# EAGLE design KNOT_v1_0_main (EAGLE 7.3.0)

## Sheet 1 of 3
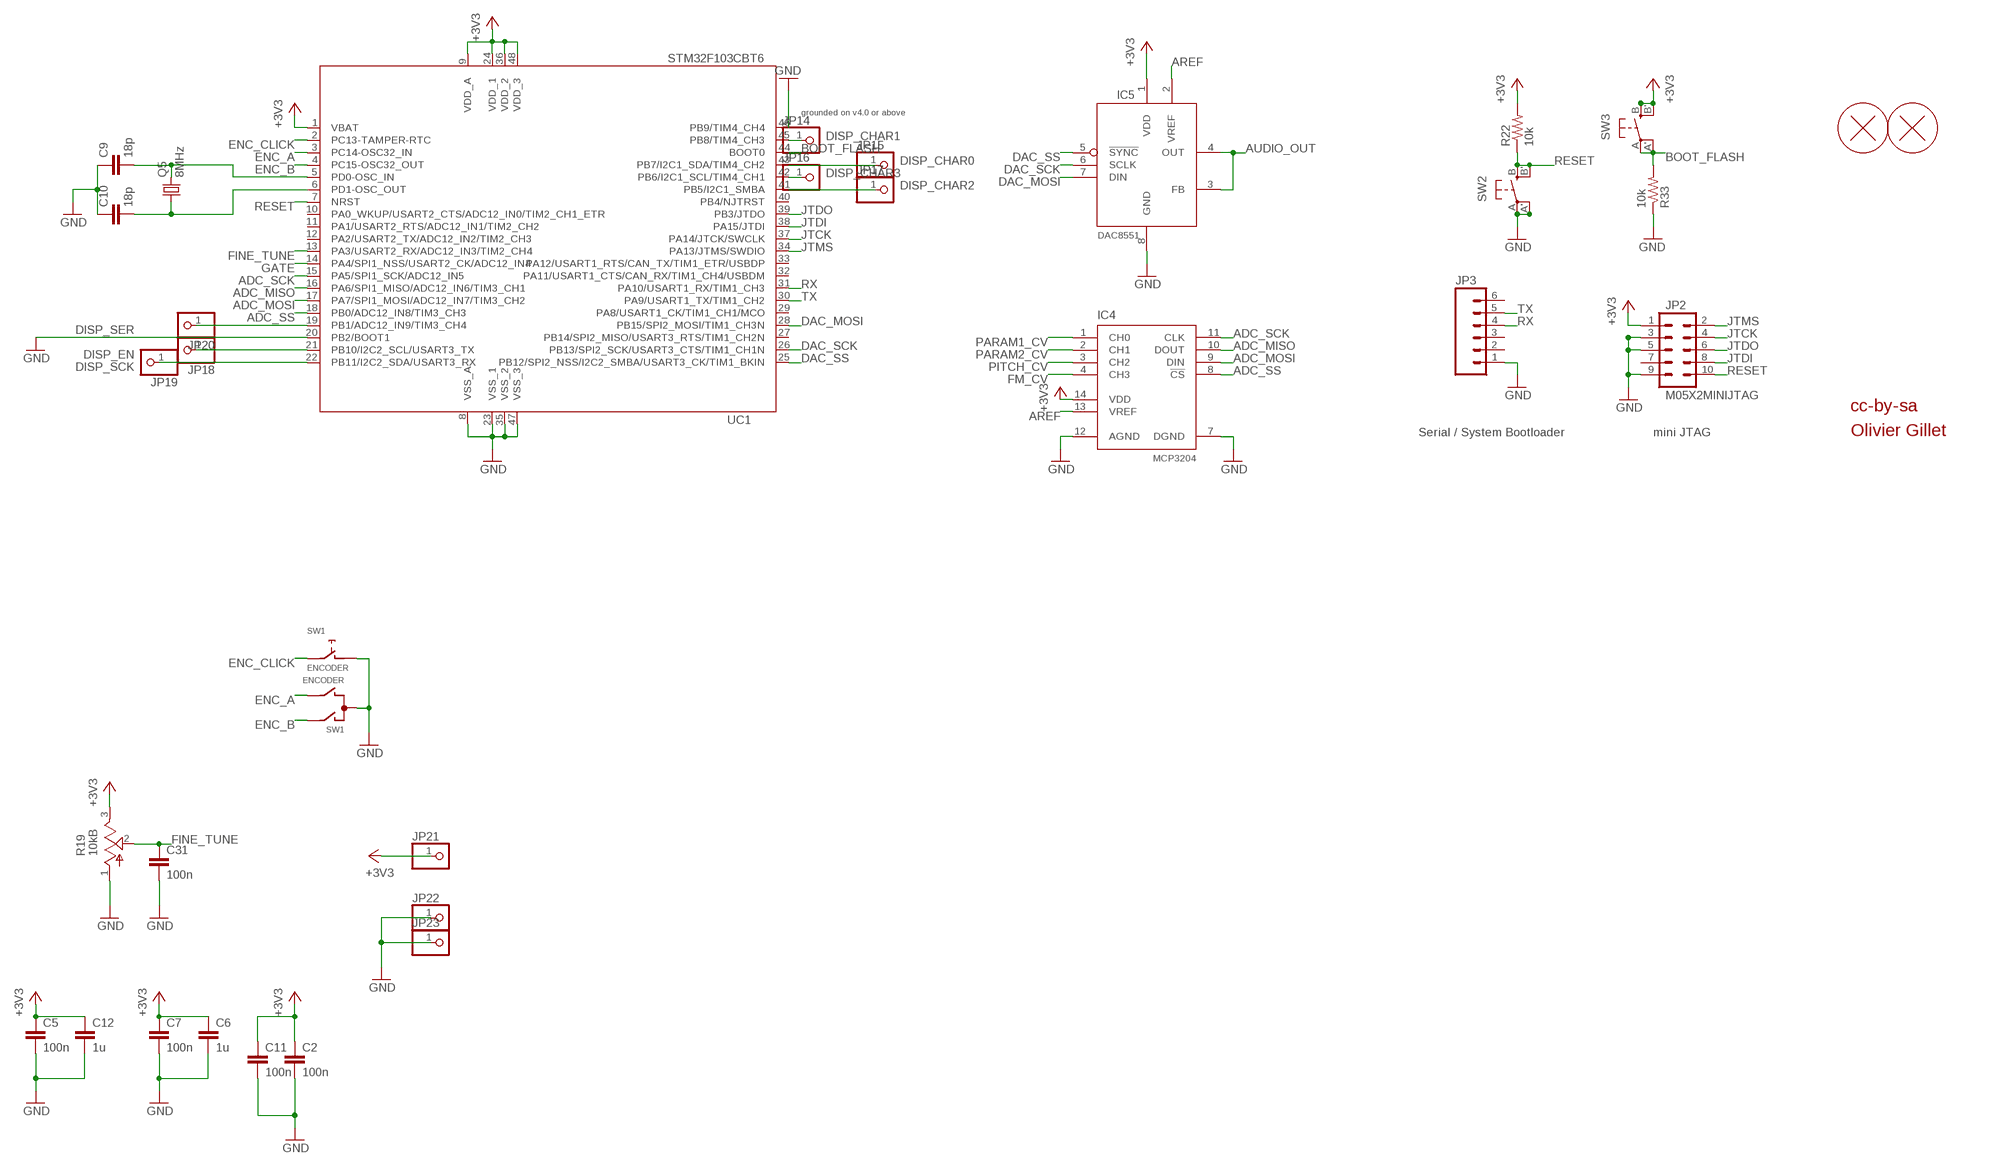
[diagram p0: schematic, sheet 1]

### Parts
C2  100n  CAPACITOR  [RESISTOR_0603]
C5  100n  CAPACITOR  [RESISTOR_0603]
C6  1u  CAPACITOR  [RESISTOR_0603]
C7  100n  CAPACITOR  [RESISTOR_0603]
C9  18p  CAPACITOR  [RESISTOR_0603]
C10  18p  CAPACITOR  [RESISTOR_0603]
C11  100n  CAPACITOR  [RESISTOR_0603]
C12  1u  CAPACITOR  [RESISTOR_0603]
C31  100n  CAPACITOR  [RESISTOR_0603]
H1  PCB_SCREW  [PCB_SCREW]
H2  PCB_SCREW  [PCB_SCREW]
IC4  MCP3204  MCP3302  [SO14]
IC5  DAC8551  DAC855X  [MSOP-8]
JP2  M05X2MINIJTAG  [2X5-1.27]
JP3  M06SIP  [1X06]
JP14  PINHD-1X1  [1X01]
JP15  PINHD-1X1  [1X01]
JP16  PINHD-1X1  [1X01]
JP17  PINHD-1X1  [1X01]
JP18  PINHD-1X1  [1X01]
JP19  PINHD-1X1  [1X01]
JP20  PINHD-1X1  [1X01]
JP21  PINHD-1X1  [1X01]
JP22  PINHD-1X1  [1X01]
JP23  PINHD-1X1  [1X01]
Q5  8MHz  CRYSTAL  [HC49UP]
R19  10kB  POT_VERTICAL  [ALPS_POT_VERTICAL]
R22  10k  RESISTOR  [RESISTOR_0603]
R33  10k  RESISTOR  [RESISTOR_0603]
SW1  ENCODER  [ALPS_EC12E_SW]
SW2  EVQQ2  [EVQ-Q2]
SW3  EVQQ2  [EVQ-Q2]
UC1  STM32F103CBT6  STM32F103CB  [LQFP48]

### Nets
+3V3 [mwide]: C2.1 C5.1 C6.1 C7.1 C11.1 C12.1 IC4.14(VDD) IC5.1(VDD) JP2.1 JP21.1 R19.3(B) R22.2 SW3.B'(S1) SW3.B(S) UC1.1(VBAT) UC1.9(VDD_A) UC1.24(VDD_1) UC1.36(VDD_2) UC1.48(VDD_3) ; also sheet 2,3
ADC_MISO: IC4.10(DOUT) UC1.16(PA6/SPI1_MISO/ADC12_IN6/TIM3_CH1)
ADC_MOSI: IC4.9(DIN) UC1.17(PA7/SPI1_MOSI/ADC12_IN7/TIM3_CH2)
ADC_SCK: IC4.11(CLK) UC1.15(PA5/SPI1_SCK/ADC12_IN5)
ADC_SS: IC4.8(!CS) UC1.18(PB0/ADC12_IN8/TIM3_CH3)
AREF: IC4.13(VREF) IC5.2(VREF) ; also sheet 3
AUDIO_OUT: IC5.3(FB) IC5.4(OUT) ; also sheet 2
BOOT_FLASH: R33.2 SW3.A'(P1) SW3.A(P) UC1.44(BOOT0)
DAC_MOSI: IC5.7(DIN) UC1.28(PB15/SPI2_MOSI/TIM1_CH3N)
DAC_SCK: IC5.6(SCLK) UC1.26(PB13/SPI2_SCK/USART3_CTS/TIM1_CH1N)
DAC_SS: IC5.5(!SYNC) UC1.25(PB12/SPI2_NSS/I2C2_SMBA/USART3_CK/TIM1_BKIN)
DISP_CHAR0: JP15.1 UC1.43(PB7/I2C1_SDA/TIM4_CH2)
DISP_CHAR1: JP14.1 UC1.45(PB8/TIM4_CH3)
DISP_CHAR2: JP17.1 UC1.41(PB5/I2C1_SMBA)
DISP_CHAR3: JP16.1 UC1.42(PB6/I2C1_SCL/TIM4_CH1)
DISP_EN: JP18.1 UC1.21(PB10/I2C2_SCL/USART3_TX)
DISP_SCK: JP19.1 UC1.22(PB11/I2C2_SDA/USART3_RX)
DISP_SER: JP20.1 UC1.19(PB1/ADC12_IN9/TIM3_CH4)
ENC_A: SW1.B UC1.3(PC14-OSC32_IN)
ENC_B: SW1.A UC1.4(PC15-OSC32_OUT)
ENC_CLICK: SW1.E UC1.2(PC13-TAMPER-RTC)
FINE_TUNE: C31.1 R19.2(W) UC1.13(PA3/USART2_RX/ADC12_IN3/TIM2_CH4)
FM_CV: IC4.4(CH3) ; also sheet 2
GATE: UC1.14(PA4/SPI1_NSS/USART2_CK/ADC12_IN4) ; also sheet 2
GND: C2.2 C5.2 C6.2 C7.2 C9.1 C10.1 C11.2 C12.2 C31.2 IC4.7(DGND) IC4.12(AGND) IC5.8(GND) JP2.3 JP2.5 JP2.9 JP3.1 JP22.1 JP23.1 R19.1(A) R33.1 SW1.C SW1.D SW2.A'(P1) SW2.A(P) UC1.8(VSS_A) UC1.20(PB2/BOOT1) UC1.23(VSS_1) UC1.35(VSS_2) UC1.46(PB9/TIM4_CH4) UC1.47(VSS_3) ; also sheet 2,3
JTCK: JP2.4 UC1.37(PA14/JTCK/SWCLK)
JTDI: JP2.8 UC1.38(PA15/JTDI)
JTDO: JP2.6 UC1.39(PB3/JTDO)
JTMS: JP2.2 UC1.34(PA13/JTMS/SWDIO)
N$7: C9.2 Q5.2 UC1.5(PD0-OSC_IN)
N$8: C10.2 Q5.1 UC1.6(PD1-OSC_OUT)
PARAM1_CV: IC4.1(CH0) ; also sheet 2
PARAM2_CV: IC4.2(CH1) ; also sheet 2
PITCH_CV: IC4.3(CH2) ; also sheet 2
RESET: JP2.10 R22.1 SW2.B'(S1) SW2.B(S) UC1.7(NRST)
RX: JP3.4 UC1.31(PA10/USART1_RX/TIM1_CH3)
TX: JP3.5 UC1.30(PA9/USART1_TX/TIM1_CH2)
Unconnected: JP2.7 JP3.2 JP3.3 JP3.6 SW1.GND1(G) SW1.GND2(G) UC1.10(PA0_WKUP/USART2_CTS/ADC12_IN0/TIM2_CH1_ETR) UC1.11(PA1/USART2_RTS/ADC12_IN1/TIM2_CH2) UC1.12(PA2/USART2_TX/ADC12_IN2/TIM2_CH3) UC1.27(PB14/SPI2_MISO/USART3_RTS/TIM1_CH2N) UC1.29(PA8/USART1_CK/TIM1_CH1/MCO) UC1.32(PA11/USART1_CTS/CAN_RX/TIM1_CH4/USBDM) UC1.33(PA12/USART1_RTS/CAN_TX/TIM1_ETR/USBDP) UC1.40(PB4/NJTRST)

### Notes on the sheet
- grounded on v4.0 or above
- cc-by-sa
- Serial / System Bootloader | mini JTAG | Olivier Gillet

## Sheet 2 of 3
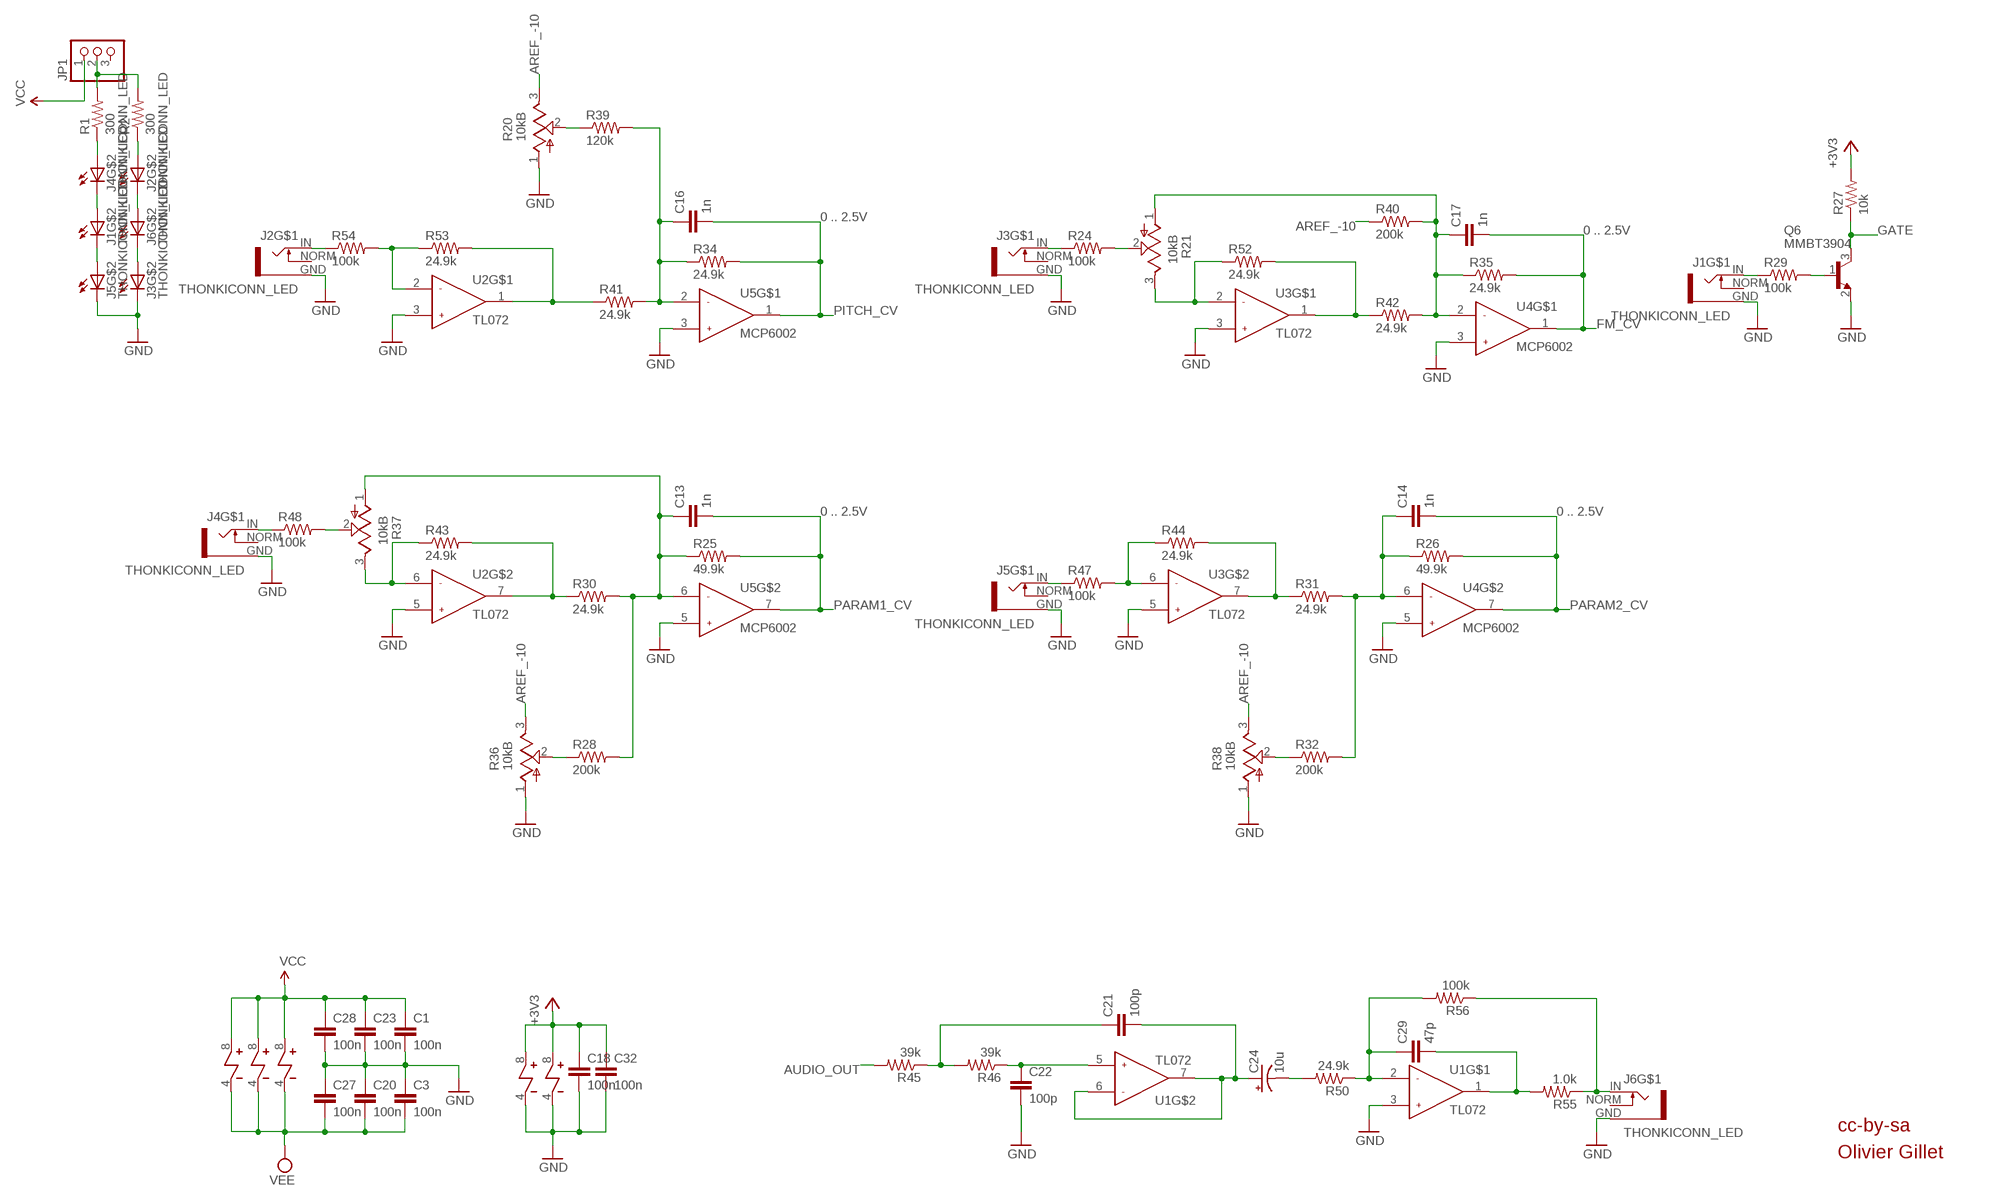
[diagram p1: schematic, sheet 2]

### Parts
C1  100n  CAPACITOR  [RESISTOR_0603]
C3  100n  CAPACITOR  [RESISTOR_0603]
C13  1n  CAPACITOR  [RESISTOR_0603]
C14  1n  CAPACITOR  [RESISTOR_0603]
C16  1n  CAPACITOR  [RESISTOR_0603]
C17  1n  CAPACITOR  [RESISTOR_0603]
C18  100n  CAPACITOR  [RESISTOR_0603]
C20  100n  CAPACITOR  [RESISTOR_0603]
C21  100p  CAPACITOR  [RESISTOR_0603]
C22  100p  CAPACITOR  [RESISTOR_0603]
C23  100n  CAPACITOR  [RESISTOR_0603]
C24  10u  CAP_POL  [PANASONIC_B]
C27  100n  CAPACITOR  [RESISTOR_0603]
C28  100n  CAPACITOR  [RESISTOR_0603]
C29  47p  CAPACITOR  [RESISTOR_0603]
C32  100n  CAPACITOR  [RESISTOR_0603]
J1  THONKICONN_LED  [LED_JACK]
J2  THONKICONN_LED  [LED_JACK]
J3  THONKICONN_LED  [LED_JACK]
J4  THONKICONN_LED  [LED_JACK]
J5  THONKICONN_LED  [LED_JACK]
J6  THONKICONN_LED  [LED_JACK]
JP1  PINHD-1X3  [1X03]
Q6  MMBT3904  MMBT3904SOT23  [SOT23]
R1  300  RESISTOR  [RESISTOR_0603]
R2  300  RESISTOR  [RESISTOR_0603]
R20  10kB  POT_VERTICAL  [ALPS_POT_VERTICAL]
R21  10kB  POT_VERTICAL  [ALPS_POT_VERTICAL]
R24  100k  RESISTOR  [RESISTOR_0603]
R25  49.9k  RESISTOR  [RESISTOR_0603]
R26  49.9k  RESISTOR  [RESISTOR_0603]
R27  10k  RESISTOR  [RESISTOR_0603]
R28  200k  RESISTOR  [RESISTOR_0603]
R29  100k  RESISTOR  [RESISTOR_0603]
R30  24.9k  RESISTOR  [RESISTOR_0603]
R31  24.9k  RESISTOR  [RESISTOR_0603]
R32  200k  RESISTOR  [RESISTOR_0603]
R34  24.9k  RESISTOR  [RESISTOR_0603]
R35  24.9k  RESISTOR  [RESISTOR_0603]
R36  10kB  POT_VERTICAL  [ALPS_POT_VERTICAL]
R37  10kB  POT_VERTICAL  [ALPS_POT_VERTICAL]
R38  10kB  POT_VERTICAL  [ALPS_POT_VERTICAL]
R39  120k  RESISTOR  [RESISTOR_0603]
R40  200k  RESISTOR  [RESISTOR_0603]
R41  24.9k  RESISTOR  [RESISTOR_0603]
R42  24.9k  RESISTOR  [RESISTOR_0603]
R43  24.9k  RESISTOR  [RESISTOR_0603]
R44  24.9k  RESISTOR  [RESISTOR_0603]
R45  39k  RESISTOR  [RESISTOR_0603]
R46  39k  RESISTOR  [RESISTOR_0603]
R47  100k  RESISTOR  [RESISTOR_0603]
R48  100k  RESISTOR  [RESISTOR_0603]
R50  24.9k  RESISTOR  [RESISTOR_0603]
R52  24.9k  RESISTOR  [RESISTOR_0603]
R53  24.9k  RESISTOR  [RESISTOR_0603]
R54  100k  RESISTOR  [RESISTOR_0603]
R55  1.0k  RESISTOR  [RESISTOR_0603]
R56  100k  RESISTOR  [RESISTOR_0603]
U1  TL072  OPAMP_DUAL  [SOIC8]
U2  TL072  OPAMP_DUAL  [SOIC8]
U3  TL072  OPAMP_DUAL  [SOIC8]
U4  MCP6002  OPAMP_DUAL  [SOIC8]
U5  MCP6002  OPAMP_DUAL  [SOIC8]

### Nets
+3V3 [mwide]: C18.1 C32.1 R27.2 U4.8 U5.8 ; also sheet 1,3
AREF_-10: R20.3(B) R36.3(B) R38.3(B) R40.1 ; also sheet 3
AUDIO_OUT: R45.2 ; also sheet 1
FM_CV: C17.2 R35.2 U4.1 ; also sheet 1
GATE: Q6.3(C) R27.1 ; also sheet 1
GND: C1.2 C3.1 C18.2 C20.1 C22.2 C23.2 C27.1 C28.2 C32.2 J1.GND J2.GND J3.C J3.GND J4.GND J5.C J5.GND J6.GND Q6.2(E) R20.1(A) R36.1(A) R38.1(A) U1.3 U2.3 U2.5 U3.3 U3.5 U4.3 U4.4 U4.5 U5.3 U5.4 U5.5 ; also sheet 1,3
N$3 [mwide]: J3.A J6.C
N$4 [mwide]: J2.C J6.A
N$5: J2.A R2.1
N$6 [mwide]: J1.C J5.A
N$9 [mwide]: J1.A J4.C
N$10 [mwide]: J4.A R1.1
N$11 [mwide]: JP1.2 R1.2 R2.2
N$12: R41.1 R53.2 U2.1
N$13: R20.2(W) R39.1
N$14: J2.IN R54.1
N$29: C16.1 R34.1 R39.2 R41.2 U5.2
N$45: R53.1 R54.2 U2.2
N$46: J3.IN R24.1
N$47: J4.IN R48.1
N$48: R21.2(W) R24.2
N$50: R37.3(B) R43.1 U2.6
N$51: R30.1 R43.2 U2.7
N$52: R21.3(B) R52.1 U3.2
N$53: R42.1 R52.2 U3.1
N$55: C17.1 R21.1(A) R35.1 R40.2 R42.2 U4.2
N$57: J1.IN R29.1
N$58: R31.1 R44.2 U3.7
N$59: C13.1 R25.1 R28.2 R30.2 R37.1(A) U5.6
N$60: J5.IN R47.1
N$61: R28.1 R36.2(W)
N$62: R37.2(W) R48.2
N$63: R44.1 R47.2 U3.6
N$65: R32.1 R38.2(W)
N$66: Q6.1(B) R29.2
N$67: C21.2 C24.+ U1.6 U1.7
N$68: C24.- R50.2
N$69: C22.1 R46.1 U1.5
N$70: C14.1 R26.1 R31.2 R32.2 U4.6
N$71: C21.1 R45.1 R46.2
N$72: J6.IN R55.1 R56.1
N$73: C29.2 R55.2 U1.1
N$75: C29.1 R50.1 R56.2 U1.2
PARAM1_CV: C13.2 R25.2 U5.7 ; also sheet 1
PARAM2_CV: C14.2 R26.2 U4.7 ; also sheet 1
PITCH_CV: C16.2 R34.2 U5.1 ; also sheet 1
VCC [wide]: C1.1 C23.1 C28.1 JP1.1 U1.8 U2.8 U3.8 ; also sheet 3
VEE [wide]: C3.2 C20.2 C27.2 U1.4 U2.4 U3.4 ; also sheet 3
Unconnected: J1.NORM J2.NORM J3.NORM J4.NORM J5.NORM J6.NORM JP1.3

### Notes on the sheet
- 0 .. 2.5V
- 0 .. 2.5V
- 0 .. 2.5V | 0 .. 2.5V
- cc-by-sa
- Olivier Gillet

## Sheet 3 of 3
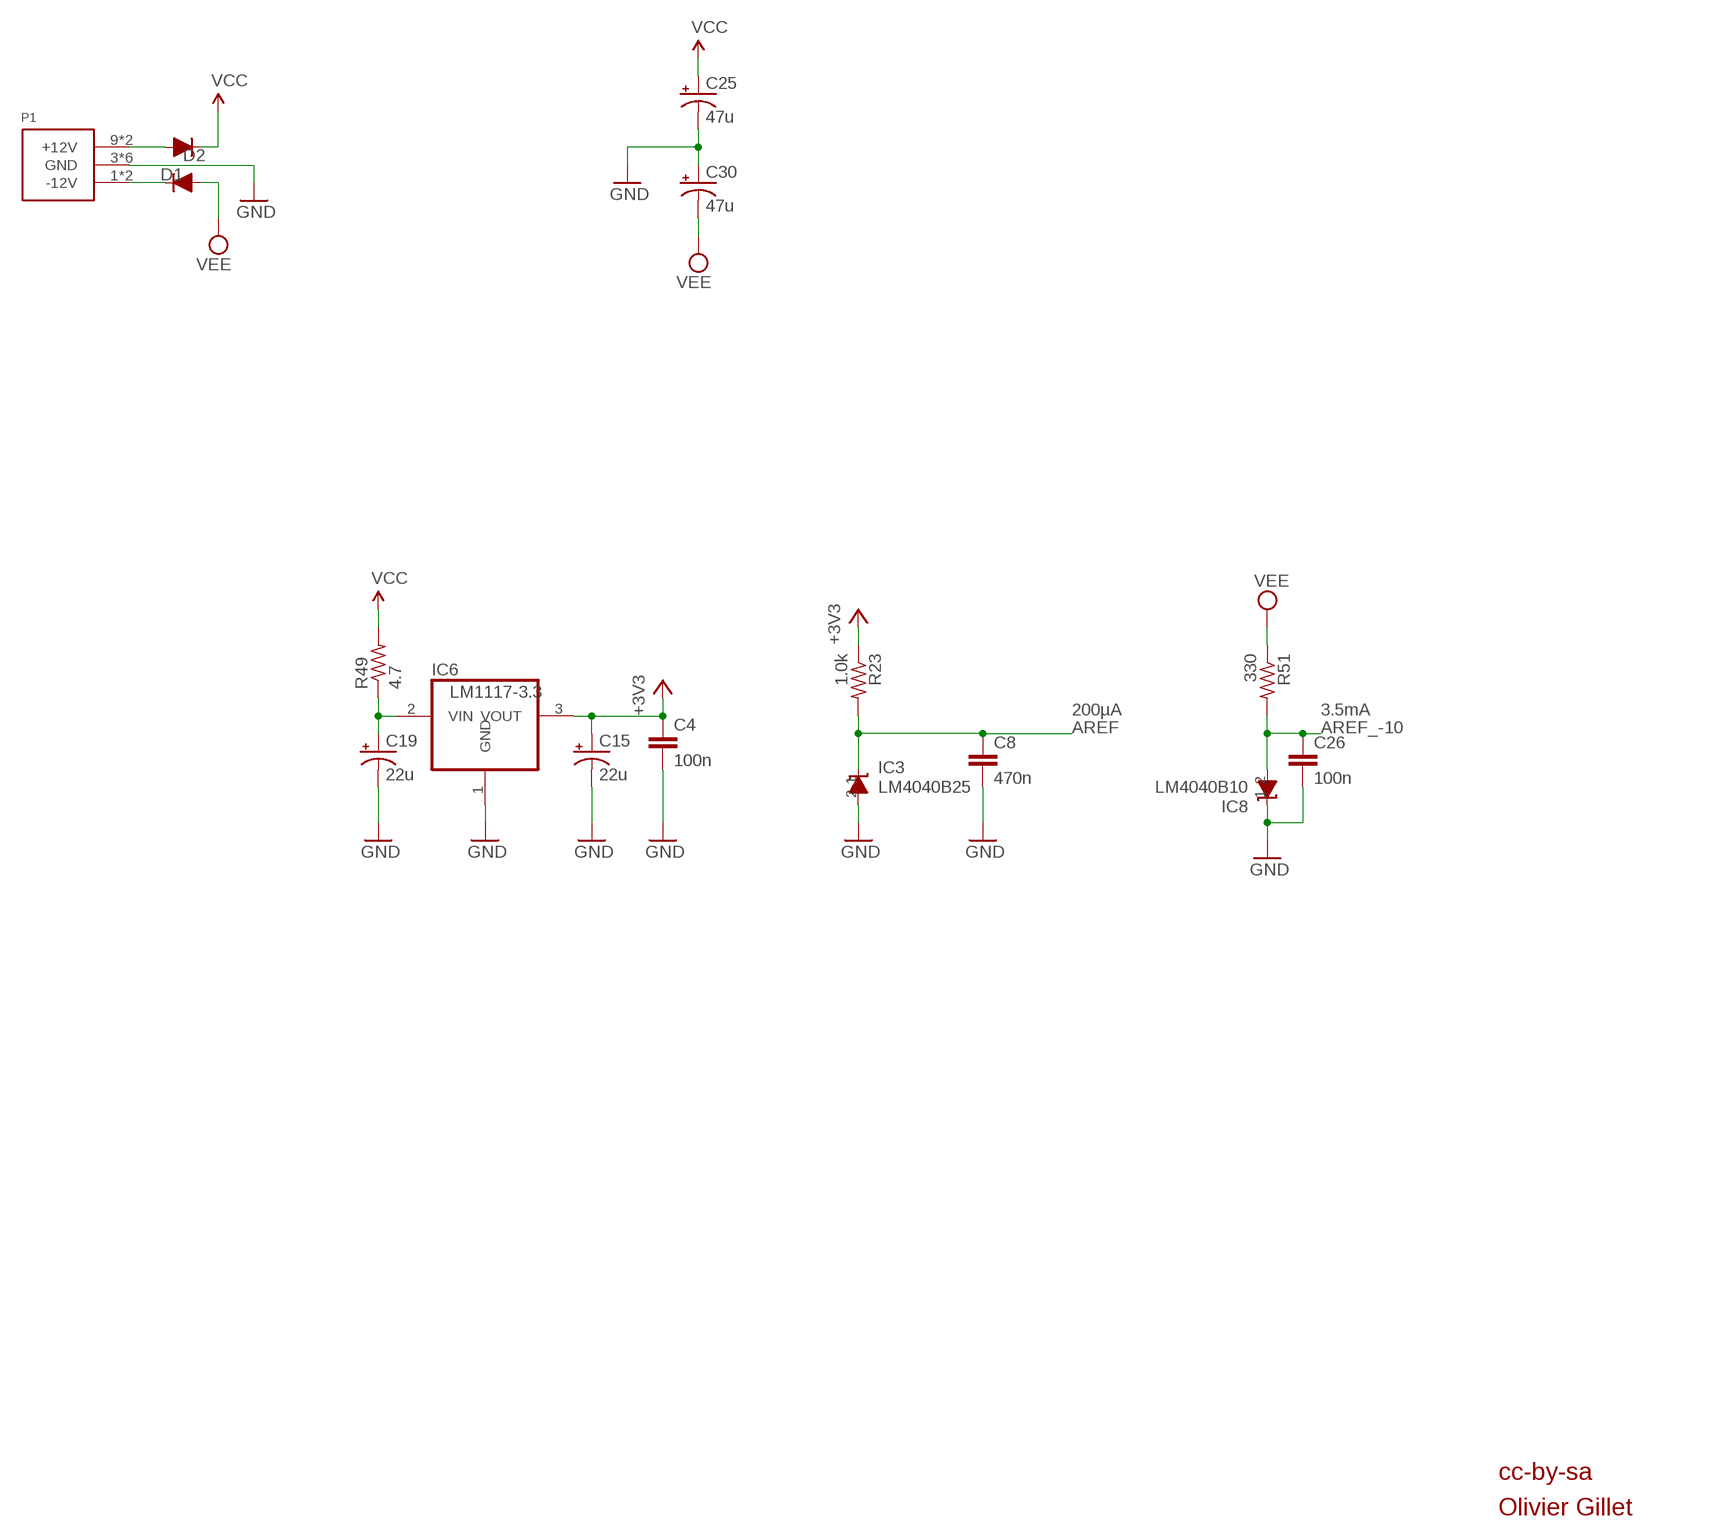
[diagram p2: schematic, sheet 3]

### Parts
C4  100n  CAPACITOR  [RESISTOR_0603]
C8  470n  CAPACITOR  [RESISTOR_0603]
C15  22u  CAP_POLD  [PANASONIC_D]
C19  22u  CAP_POLD  [PANASONIC_D]
C25  47u  CAP_POLD  [PANASONIC_D]
C26  100n  CAPACITOR  [RESISTOR_0603]
C30  47u  CAP_POLD  [PANASONIC_D]
D1  1N5819HW  DIODE  [SOD123]
D2  1N5819HW  DIODE  [SOD123]
IC3  LM4040B25  LM4040SOT23  [SOT23]
IC6  LM1117-3.3  REG1117T  [TO252]
IC8  LM4040B10  LM4040SOT23  [SOT23]
P1  POWER_SIMPLE10  [POWER_10]
R23  1.0k  RESISTOR  [RESISTOR_0603]
R49  4.7  RESISTOR  [RESISTOR_0603]
R51  330  RESISTOR  [RESISTOR_0603]

### Nets
+3V3 [mwide]: C4.1 C15.+ IC6.3(VOUT) R23.1 ; also sheet 1,2
AREF: C8.1 IC3.1(C) R23.2 ; also sheet 1
AREF_-10: C26.1 IC8.2(A) R51.2 ; also sheet 2
GND: C4.2 C8.2 C15.- C19.- C25.- C26.2 C30.+ IC3.2(A) IC6.1(GND) IC8.1(C) P1.3(GND) P1.4(GND) P1.5(GND) P1.6(GND) P1.7(GND) P1.8(GND) ; also sheet 1,2
N$1 [wide]: D1.+ P1.9(+12V) P1.10(+12V)
N$2 [wide]: D2.- P1.1(-12V) P1.2(-12V)
N$49: C19.+ IC6.2(VIN) R49.1
VCC [wide]: C25.+ D1.- R49.2 ; also sheet 2
VEE [wide]: C30.- D2.+ R51.1 ; also sheet 2

### Notes on the sheet
- 200µA | 3.5mA
- cc-by-sa
- Olivier Gillet

## Library data of the parts
C1-C14 C16-C18 C20-C23 C26-C29 C31 C32 = parts_aman:CAPACITOR
C15 C19 C24 C25 C30 = parts_aman:CAP_POL
D1 D2 = parts_aman:DIODE
H1 H2 = parts_aman:PCB_SCREW
IC3 IC8 = parts_aman:LM4040
IC4 = og-adc:MCP3302
IC5 = og-dac:DAC855X: 16-bit low-glitch DAC with 2's complement (8550) or unsigned code (8551)
IC6 = og-vreg:REG1117: 800mA and 1A Low Dropout (LDO) Positive Regulator 1.8V, 2.5V, 2.85V, 3.3V, 5V, and Adj
J1-J6 = parts_aman:THONKICONN_LED
JP1 = parts_aman:PINHD-1X3: PIN HEADER
JP2 = og-header:M05X2: Header 5x2 Standard 10-pin dual row 0.1" header. Commonly used with AVR-ISP. Use with Spark Fun Electronics SKU: PRT-00778
JP3 = SparkFun:M06: Header 6 Standard 6-pin 0.1" header. Use with straight break away headers (SKU : PRT-00116), right angle break away headers (PRT-00553), swiss pins (PRT-00743), machine pins (PRT-00117), and female headers (PRT-00115). Molex polarized connector foot print use with SKU : PRT-08094 with associated crimp pins and housings. NOTES ON THE VARIANTS LOCK and LOCK_LONGPADS... This footprint was designed to help hold the alignment of a through-hole component (i.e. 6-pin header) while soldering it into place. You may notice that each hole has been shifted either up or down by 0.005 of an inch from it's more standard position (which is a perfectly straight line). This slight alteration caused the pins (the squares in the middle) to touch the edges of the holes. Because they are alternating, it causes a "brace" to hold the component in place. 0.005 has proven to be the perfect amount of "off-center" position when using our standard breakaway headers. Although looks a little odd when you look at the bare footprint, once you have a header in there, the alteration is very hard to notice. Also, if you push a header all the way into place, it is covered up entirely on the bottom side. This idea of altering the position of holes to aid alignment will be further integrated into the Sparkfun Library for other footprints. It can help hold any component with 3 or more connection pins.
JP14-JP23 = parts_aman:PINHD-1X1: PIN HEADER
P1 = parts_aman:POWER_SIMPLE
Q5 = parts_aman:CRYSTAL
Q6 = parts_aman:MMBT3904
R1 R2 R22-R35 R39-R56 = parts_aman:RESISTOR
R19-R21 R36-R38 = parts_aman:POT_VERTICAL
SW1 = parts_aman:ENCODER: ALPS rotary Encoder EC12E series with switch; MPN: EC12E2424407; OC_FARNELL: 1520813; OC_NEWARK: 74M1068
SW2 SW3 = adafruit:EVQQ2: SMT 6mm switch, EVQQ2 series http://www.ladyada.net/library/eagle
U1-U5 = parts_aman:OPAMP_DUAL
UC1 = stm32:STM32F103CB

## Net classes
0 default: width 0.152 mm, drill 0.305 mm, clearance 0.152 mm
1 wide: width 0.305 mm, drill 0.305 mm, clearance 0.152 mm
2 mwide: width 0.229 mm, drill 0.305 mm, clearance 0.152 mm

## Board
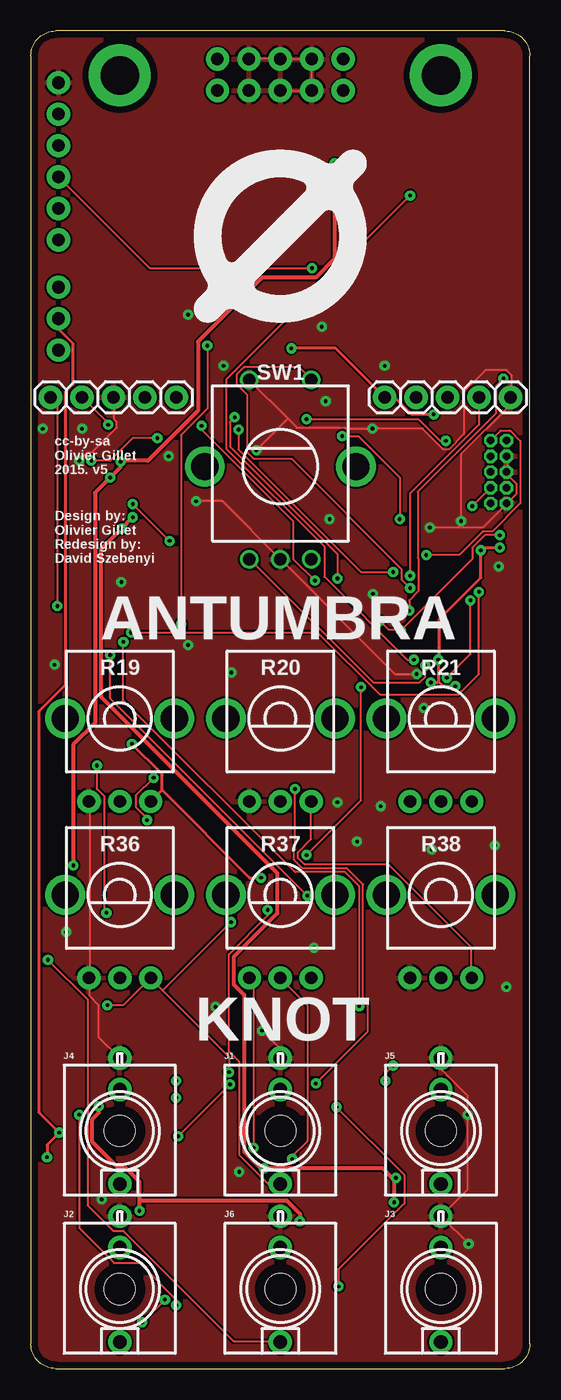
[diagram p3: board, top side]
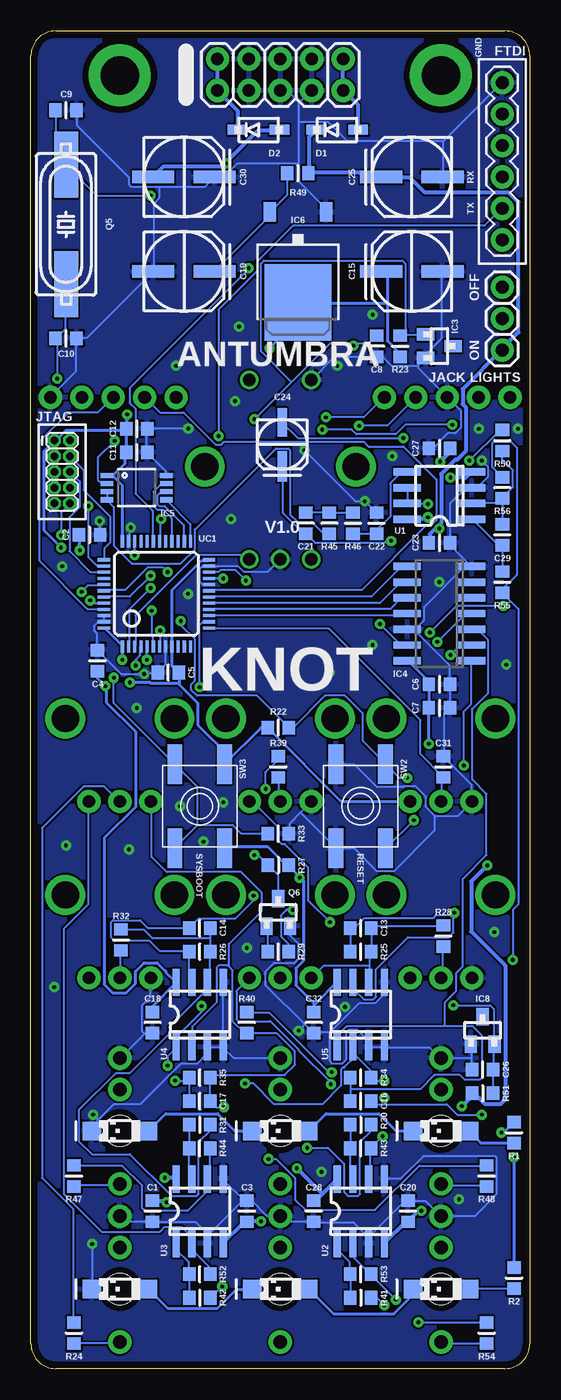
[diagram p4: board, bottom side, seen from below]

Size 40.3 x 108 mm. Coordinates in mm from the lower left corner, seen from the top.
Outline: 2,0 38.3,0 arc90 40.3,2 40.3,106 arc90 38.3,108 2,108 arc90 0,106 0,2 arc90 2,0
Copper layers (1*16): Top 0.035mm / dielectric 1.5mm / Bottom 0.035mm
Design rules "PCBCart-Standard": minimum track width 6mil, minimum drill 12mil, track to track 6mil, track to pad 6mil, pad to pad 6mil, via to via 6mil, smd to smd 6mil, copper to edge 20mil, drill to drill 8mil, minimum pad ring 8mil, minimum via ring 10mil, stop-mask expansion 3mil, vias tented up to drill 25mil, thermal gap 8mil

### Footprints (pad centres in the part's own frame; a part is rotated, then mirrored left to right if it is on the bottom)
RESISTOR_0603 = smd 1 x 1.1: 1 -0.85,0; 2 0.85,0
PANASONIC_D = smd 3.4 x 1: + 2.478,0; - -2.478,0
PANASONIC_B = smd 2.464 x 0.762: + 1.778,0 | smd 2.286 x 0.762: - -1.778,0
SOD123 = smd 1.6 x 0.8: + 1.7,0; - -1.7,0
PCB_SCREW = drill 3.1 pad 5: P$1 0,0
SOT23 = smd 1 x 1.4: 1 -0.95,-1.1; 2 0.95,-1.1; 3 0,1.1
SO14 = smd 0.6 x 2.2: 1 -3.81,-2.6; 2 -2.54,-2.6; 3 -1.27,-2.6; 4 0,-2.6; 5 1.27,-2.6; 6 2.54,-2.6; 7 3.81,-2.6; 8 3.81,2.6; 9 2.54,2.6; 10 1.27,2.6; 11 0,2.6; 12 -1.27,2.6; 13 -2.54,2.6; 14 -3.81,2.6
MSOP-8 = smd 0.41 x 1.02: 1 -0.975,-2.4; 2 -0.325,-2.4; 3 0.325,-2.4; 4 0.975,-2.4; 5 0.975,2.4; 6 0.325,2.4; 7 -0.325,2.4; 8 -0.975,2.4
TO252 = smd 1 x 1.6: 1 -2.28,-4.8; 2 2.28,-4.8 | smd 5.4 x 6.2: 3 0,2.5
LED_JACK = smd 1.5 x 1.5 bottom: A 2.266,0; C -2.266,0 | drill 1.1 pad 1.88: GND 0,-5.88; IN 0,4.28; NORM 0,-3.34 | hole 2.5: 0,0
1X03 = drill 1.016 pad 1.88: 1 -2.54,0; 2 0,0; 3 2.54,0
2X5-1.27 = drill 0.61 pad 1.067 octagon: 1 -1.27,3.81; 2 0,3.81; 3 -1.27,2.54; 4 0,2.54; 5 -1.27,1.27; 6 0,1.27; 7 -1.27,0; 8 0,0; 9 -1.27,-1.27; 10 0,-1.27
1X06 = drill 1.016 pad 1.88: 1 0,0; 2 2.54,0; 3 5.08,0; 4 7.62,0; 5 10.16,0; 6 12.7,0
1X01 = drill 1.016 pad 1.88: 1 0,0
POWER_10 = drill 1.016 pad 1.88: 1 -5.08,-1.27; 2 -5.08,1.27; 3 -2.54,-1.27; 4 -2.54,1.27; 5 0,-1.27; 6 0,1.27; 7 2.54,-1.27; 8 2.54,1.27; 9 5.08,-1.27; 10 5.08,1.27
HC49UP = smd 5.334 x 1.93: 1 -4.826,0; 2 4.826,0
ALPS_POT_VERTICAL = drill 1 pad 1.88: 1 -2.5,-6.7; 2 0,-6.7; 3 2.5,-6.7 | drill 2.2 pad 3.175: P$4 4.4,0; P$5 -4.4,0
ALPS_EC12E_SW = drill 1: A -2.5,-7.5; B 2.5,-7.5; C 0,-7.5; D -2.5,7; E 2.5,7 | drill 2.2: GND1 -6.1,0; GND2 6.1,0
EVQ-Q2 = smd 3.2 x 1.2: A -3.4,-2; A' 3.4,-2; B -3.4,2; B' 3.4,2
SOIC8 = smd 0.6 x 2.2: 1 -1.905,-2.6; 2 -0.635,-2.6; 3 0.635,-2.6; 4 1.905,-2.6; 5 1.905,2.6; 6 0.635,2.6; 7 -0.635,2.6; 8 -1.905,2.6
LQFP48 = smd 0.254 x 1: 1 -2.75,-4.25; 2 -2.25,-4.25; 3 -1.75,-4.25; 4 -1.25,-4.25; 5 -0.75,-4.25; 6 -0.25,-4.25; 7 0.25,-4.25; 8 0.75,-4.25; 9 1.25,-4.25; 10 1.75,-4.25; 11 2.25,-4.25; 12 2.75,-4.25; 25 2.75,4.25; 26 2.25,4.25; 27 1.75,4.25; 28 1.25,4.25; 29 0.75,4.25; 30 0.25,4.25; 31 -0.25,4.25; 32 -0.75,4.25; 33 -1.25,4.25; 34 -1.75,4.25; 35 -2.25,4.25; 36 -2.75,4.25 | smd 1 x 0.254: 13 4.25,-2.75; 14 4.25,-2.25; 15 4.25,-1.75; 16 4.25,-1.25; 17 4.25,-0.75; 18 4.25,-0.25; 19 4.25,0.25; 20 4.25,0.75; 21 4.25,1.25; 22 4.25,1.75; 23 4.25,2.25; 24 4.25,2.75; 37 -4.25,2.75; 38 -4.25,2.25; 39 -4.25,1.75; 40 -4.25,1.25; 41 -4.25,0.75; 42 -4.25,0.25; 43 -4.25,-0.25; 44 -4.25,-0.75; 45 -4.25,-1.25; 46 -4.25,-1.75; 47 -4.25,-2.25; 48 -4.25,-2.75

### Placement (x,y rotation side)
C1  30.48,12.7 270 bottom
C2  35.56,67.31 0 bottom
C3  22.86,12.7 270 bottom
C4  34.92,57.15 90 bottom
C5  29.21,56.2 180 bottom
C6  7.3,55.24 0 bottom
C7  7.3,53.34 0 bottom
C8  12.38,82.55 270 bottom
C9  37.47,101.6 180 bottom
C10  37.47,83.19 180 bottom
C11  31.75,73.98 0 bottom
C12  31.75,75.88 0 bottom
C13  13.65,35.56 180 bottom
C14  26.67,35.56 180 bottom
C15  9.53,88.58 180 bottom
C16  13.65,21.59 180 bottom
C17  26.67,21.59 180 bottom
C18  30.48,27.94 270 bottom
C19  27.94,88.58 0 bottom
C20  9.84,12.7 270 bottom
C21  18.1,68.26 270 bottom
C22  12.38,68.26 90 bottom
C23  7.3,66.67 0 bottom
C24  20,74.61 270 bottom
C25  9.53,96.2 180 bottom
C26  3.81,24.13 180 bottom
C27  7.3,74.3 0 bottom
C28  17.46,12.7 270 bottom
C29  2.22,67.31 270 bottom
C30  27.94,96.2 0 bottom
C31  6.99,48.58 90 bottom
C32  17.46,27.94 270 bottom
D1  15.56,100.01 0 bottom
D2  21.91,100.01 0 bottom
H1  33.12,104.42 0 top
H2  7.17,104.42 0 top
IC3  7.3,82.55 270 bottom
IC4  7.3,60.96 90 bottom
IC5  31.75,71.12 270 bottom
IC6  18.73,88.58 180 bottom
IC8  3.81,27.3 0 bottom
J1  20.15,19.19 180 top
J2  7.17,6.42 180 top
J3  33.12,6.42 180 top
J4  7.17,19.19 180 top
J5  33.12,19.19 180 top
J6  20.15,6.42 180 top
JP1  2.22,84.77 90 bottom
JP2  37.15,71.12 0 bottom
JP3  2.22,103.82 270 bottom
JP14  33.66,78.42 0 top
JP15  36.2,78.42 0 top
JP16  4.13,78.42 0 top
JP17  1.59,78.42 0 top
JP18  11.75,78.42 0 top
JP19  9.21,78.42 0 top
JP20  31.11,78.42 0 top
JP21  28.57,78.42 0 top
JP22  6.67,78.42 0 top
JP23  38.73,78.42 0 top
P1  20.15,104.46 0 bottom
Q5  37.47,92.39 90 bottom
Q6  20.32,36.83 0 bottom
R1  1.27,19.05 90 bottom
R2  1.27,7.3 90 bottom
R19  7.17,52.48 0 top
R20  20.15,52.48 0 top
R21  33.12,52.48 0 top
R22  20.32,51.75 180 bottom
R23  10.48,82.55 90 bottom
R24  36.83,2.86 90 bottom
R25  13.65,33.66 180 bottom
R26  26.67,33.66 180 bottom
R27  20.32,40.64 0 bottom
R28  6.99,34.92 90 bottom
R29  20.32,33.66 180 bottom
R30  13.65,19.68 0 bottom
R31  26.67,19.68 0 bottom
R32  33.02,34.61 90 bottom
R33  20.32,43.18 180 bottom
R34  13.65,23.5 180 bottom
R35  26.67,23.5 180 bottom
R36  7.17,38.24 0 top
R37  20.15,38.24 0 top
R38  33.12,38.24 0 top
R39  20.32,48.58 90 bottom
R40  22.86,27.94 270 bottom
R41  13.65,5.71 0 bottom
R42  26.67,5.71 0 bottom
R43  13.65,17.78 180 bottom
R44  26.67,17.78 180 bottom
R45  16.19,68.26 270 bottom
R46  14.29,68.26 90 bottom
R47  36.83,15.56 90 bottom
R48  3.49,15.56 90 bottom
R49  18.73,96.52 0 bottom
R50  2.22,74.93 90 bottom
R51  3.81,22.23 0 bottom
R52  26.67,7.62 180 bottom
R53  13.65,7.62 180 bottom
R54  3.49,2.86 90 bottom
R55  2.22,63.5 90 bottom
R56  2.22,71.12 270 bottom
SW1  20.15,72.83 0 top
SW2  13.65,45.4 270 bottom
SW3  26.67,45.4 270 bottom
U1  7.3,70.48 90 bottom
U2  13.65,12.7 0 bottom
U3  26.67,12.7 0 bottom
U4  26.67,28.57 0 bottom
U5  13.65,28.57 0 bottom
U$1  [LOGO_14]  20.15,91.44 0 top
UC1  30.16,62.55 0 bottom

### Tracks (layer width: path | path; a pad name or v marks a point on that pad's centre or on a via)
+3V3  (via drill 0.3)
  Top 0.229: v32.54,77.04 30.79,77.04 29.41,78.41 JP21.1 28.5,78.49 24.61,82.37 v21.03,82.37 | v34.29,55.09 33.3,55.09 32.92,55.47 | 32.92,55.47 v32.92,57.23 32.99,57.3 32.99,60.5 36.35,63.86 v36.35,66.06 36.58,66.29 v37.87,66.29 | v8.15,50.44 10.59,48.01 10.59,46.71 | 10.59,46.71 9.68,45.8 R19.3 | v18.59,39.62 17.68,39.62 10.59,46.71 | v32.31,55.4 32.84,55.4 32.92,55.47
  Bottom 0.229: 11.51,86.03 11.51,88.09 11.96,88.54 C15.+ | 11.51,86.03 11.51,82.98 10.52,81.99 10.52,81.76 R23.1 | 11.51,86.03 18.67,86.03 IC6.3 18.75,85.95 18.75,84.66 v21.03,82.37 | C12.1 32.61,75.82 32.61,73.99 C11.1 32.69,73.91 32.69,73.08 33.68,72.08 | 33.68,72.08 32.92,71.32 32.92,66.83 UC1.36 | 33.68,72.08 34.14,72.08 IC5.1 | C12.1 32.69,75.74 37.49,75.74 38.25,74.98 38.41,74.98 JP2.1 38.48,74.83 39.24,74.07 39.24,67.67 v37.87,66.29 | v32.54,77.04 32.54,75.97 C12.1 | C18.1 30.48,29.26 28.57,31.17 U4.8 28.65,31.24 29.41,32 29.41,32.08 30.1,32.77 31.17,32.77 31.85,32.08 31.85,31.09 32.61,30.33 33.68,30.33 34.37,31.01 34.37,42.82 31.85,45.34 31.85,51.44 34.21,53.8 34.21,55.02 v34.29,55.09 34.9,55.7 34.9,56.24 C4.1 | UC1.48 34.37,59.82 32.92,58.37 UC1.1 32.92,58.22 v32.92,57.23 | v36.35,66.06 36.35,67.28 C2.1 | 17.37,29.41 15.62,31.17 U5.8 | 17.37,29.41 17.45,29.34 17.45,28.8 C32.1 | SW3.B' 24.61,42.06 24.54,42.14 21.18,42.14 19.74,40.69 19.51,40.69 R27.2 19.43,40.54 18.55,39.66 | 17.37,29.41 18.9,30.94 18.9,32.31 18.29,32.92 18.29,39.4 18.55,39.66 | IC4.14 9.83,57.15 8.23,55.55 8.23,55.32 C6.1 C7.1 8.15,53.26 v8.15,50.44 | UC1.24 25.98,65.23 26.52,65.23 28.88,62.87 28.88,58.37 UC1.9 28.88,58.29 28.88,56.69 28.42,56.24 C5.1 28.35,56.08 28.35,55.24 | 28.35,55.24 26.82,53.72 26.82,51.97 24.23,49.38 SW3.B 24.61,48.84 21.72,51.74 21.18,51.74 R22.2 21.11,51.66 15.24,45.8 9.68,45.8 R19.3 | v18.59,39.62 18.55,39.66 | v32.31,55.4 30.71,55.4 30.63,55.32 28.42,55.32 28.35,55.24
ADC_MISO
  Bottom 0.152: UC1.16 25.91,61.34 11.28,61.34 10.44,62.18 9.91,62.18 IC4.10
ADC_MOSI
  Bottom 0.152: UC1.17 12.12,61.8 10.44,63.48 9.91,63.48 IC4.9
ADC_SCK
  Bottom 0.152: UC1.15 10.06,60.81 IC4.11
ADC_SS
  Bottom 0.152: IC4.8 10.36,64.77 12.8,62.33 25.91,62.33 UC1.18
AREF  (via drill 0.3)
  Top 0.152: v33.53,74.91 33.07,74.91 31.32,76.66 v22.25,76.66 | v12.12,60.12 12.12,75.36 14.25,77.5 v14.25,82.6
  Bottom 0.152: 10.06,83.44 8.46,83.44 IC3.1 | 10.06,83.44 10.44,83.44 R23.2 10.06,83.44 | v33.53,74.91 34.9,73.53 34.9,71.78 34.59,71.48 34.21,71.48 IC5.2 | 19.24,79.67 16.15,82.75 14.25,82.75 | 19.24,79.67 v22.25,76.66 | 14.25,82.75 13.03,82.75 12.42,83.36 C8.1 | 10.06,83.44 10.06,89.23 10.29,89.46 21.49,89.46 21.72,89.23 21.72,82.14 19.24,79.67 | v12.12,60.12 10.44,58.45 9.91,58.45 IC4.13 | 14.25,82.75 v14.25,82.6
AREF_-10  (via drill 0.3)
  Top 0.152: v16,23.93 16,25.15 10.63,30.52 | 10.63,30.52 9.68,31.47 R36.3 9.6,31.47 7.47,29.34 v6.17,29.34 | R20.3 22.63,45.72 22.63,42.75 21.57,41.68 21.57,41.22 22.1,40.69 28.88,40.69 35.59,33.98 35.59,31.55 R38.3 | v16.15,36.04 10.63,30.52
  Bottom 0.152: R51.2 2.97,22.25 2.97,24.08 C26.1 2.9,24.16 2.9,26.14 IC8.2 2.9,26.21 2.9,29.03 3.2,29.34 v6.17,29.34 | v16,23.93 16.23,23.93 21.03,28.73 22.86,28.73 R40.1 | v16.15,36.04 17.91,37.8 17.91,40.46 19.81,42.37 20.04,42.37 20.42,42.75 20.42,43.81 22.33,45.72 22.63,45.72 R20.3
AUDIO_OUT
  Bottom 0.152: IC5.3 34.14,70.79 34.14,70.18 IC5.4 34.14,70.1 33.6,69.57 33.6,66.45 32.16,65 28.19,65 27.05,66.14 27.05,67.74 20.5,74.3 19.51,74.3 19.36,74.14 19.36,68.96 18.75,68.35 17.6,68.35 16.69,67.44 16.23,67.44 R45.2
BOOT_FLASH  (via drill 0.3)
  Top 0.152: v35.51,62.03 35.51,57.68 v33.6,55.78
  Bottom 0.152: 26.86,43.85 28.65,42.06 SW3.A' | 26.86,43.85 26.82,43.89 24,43.89 23.32,43.2 21.18,43.2 R33.2 | v35.51,62.03 35.28,61.8 34.44,61.8 UC1.44 | v33.6,55.78 33.6,53.72 28.73,48.84 SW3.A 28.65,48.77 26.9,47.02 26.9,43.89 26.86,43.85
DAC_MOSI
  Bottom 0.152: UC1.28 28.96,66.83 28.96,68.66 29.64,69.34 30.1,69.34 30.4,69.65 30.4,70.79 29.79,71.4 29.41,71.4 IC5.7
DAC_SCK
  Bottom 0.152: UC1.26 27.96,66.83 27.96,68.12 29.49,69.65 29.95,69.65 30.1,69.8 30.1,70.48 29.79,70.79 29.41,70.79 IC5.6
DAC_SS
  Bottom 0.152: UC1.25 27.43,66.83 27.43,68.2 29.34,70.1 IC5.5
DISP_CHAR0  (via drill 0.3)
  Top 0.152: v30.63,64.01 30.63,70.64 36.2,76.2 JP15.1
  Bottom 0.152: v30.63,64.01 32.31,62.33 34.37,62.33 UC1.43
DISP_CHAR1
  Bottom 0.152: UC1.45 34.44,61.34 35.74,61.34 39.62,65.23 39.62,74.83 37.26,77.19 34.9,77.19 33.68,78.41 JP14.1
DISP_CHAR2  (via drill 0.3)
  Top 0.152: v36.2,62.71 36.2,56.08 34.52,54.41 28.19,54.41 23.16,59.44 v8.08,59.44 | v2.13,61.57 2.13,77.88 JP17.1
  Bottom 0.152: v36.2,62.71 35.66,63.25 34.44,63.25 UC1.41 | v8.08,59.44 5.94,61.57 v2.13,61.57
DISP_CHAR3  (via drill 0.3)
  Top 0.152: v29.26,64.31 26.67,64.31 16.76,74.22 v16.76,75.82 | v6.25,76.2 6.25,76.35 4.19,78.41 JP16.1
  Bottom 0.152: v29.26,64.31 29.64,64.69 30.86,64.69 32.69,62.87 34.37,62.87 UC1.42 | v16.76,75.82 14.4,75.82 14.02,75.44 10.82,75.44 10.06,76.2 v6.25,76.2
DISP_EN  (via drill 0.3)
  Top 0.152: v24.77,63.78 24.77,65.76 16.08,74.45 16.08,76.43 v16.46,76.81
  Bottom 0.152: v24.77,63.78 25.91,63.78 UC1.21 | v16.46,76.81 13.41,76.81 11.81,78.41 JP18.1
DISP_SCK  (via drill 0.3)
  Top 0.152: v22.94,63.63 21.18,65.38 21.18,68.43 13.79,75.82 v13.79,76.12
  Bottom 0.152: v22.94,63.63 23.77,64.47 24.99,64.47 25.15,64.31 25.91,64.31 UC1.22 | v13.79,76.12 11.51,76.12 JP19.1
DISP_SER
  Bottom 0.152: UC1.19 25.91,62.87 13.56,62.87 8.38,68.05 8,68.05 7.54,68.5 7.54,71.78 10.21,74.45 13.03,74.45 13.41,74.83 24.69,74.83 24.92,74.6 25.38,74.6 27.96,77.19 29.87,77.19 31.09,78.41 JP20.1
ENC_A
  Bottom 0.152: UC1.3 31.85,58.37 31.85,60.81 26.98,65.68 23.01,65.68 22.71,65.38 SW1.B
ENC_B  (via drill 0.3)
  Top 0.152: v31.85,56.77 31.85,55.85 31.39,55.4 27.66,55.4 17.68,65.38 SW1.A
  Bottom 0.152: v31.85,56.77 31.85,57.23 31.47,57.61 31.47,58.29 UC1.4
ENC_CLICK  (via drill 0.3)
  Top 0.152: v30.63,63.02 29.95,63.7 29.95,64.54 21.03,73.46 17.98,73.46 17.45,73.99 17.45,78.64 16.61,79.48 16.61,80.24 17.22,80.85 21.64,80.85 22.63,79.86 SW1.E
  Bottom 0.152: v30.63,63.02 32.38,61.27 32.38,58.37 UC1.2
FINE_TUNE
  Bottom 0.152: UC1.13 25.91,59.74 16.23,59.74 8.84,52.35 8.84,49.61 7.01,47.78 C31.1 7.01,47.7 7.16,47.55 7.16,45.8 R19.2
FM_CV  (via drill 0.3)
  Top 0.152: v28.65,23.24 28.65,23.85 v29.26,24.46 | v7.47,58.67 7.47,53.95 21.34,40.08 25.38,40.08 26.52,38.94 v26.52,29.26
  Bottom 0.152: 27.51,23.24 27.51,23.47 R35.2 27.51,23.24 | 27.51,23.24 27.51,21.64 C17.2 | v28.65,23.24 27.51,23.24 | v29.26,24.46 29.26,25.22 28.57,25.91 U4.1 28.57,26.75 26.52,28.8 v26.52,29.26 | IC4.4 5.18,60.96 v7.47,58.67
GATE  (via drill 0.3)
  Top 0.152: v26.67,55.02 26.67,45.87 v22.25,41.45
  Bottom 0.152: v26.67,55.02 26.67,60.05 26.44,60.27 25.98,60.27 UC1.14 | v22.25,41.45 21.95,41.45 21.18,40.69 R27.1 21.11,40.62 20.34,39.85 20.34,37.95 Q6.3
GND  (via drill 0.3)
  Top 0.152: v13.34,70.03 15.47,70.03 20.12,65.38 SW1.C 20.19,65.3 29.41,56.08 v31.17,56.08 | 20.77,76.69 17.68,79.78 SW1.D | 20.77,76.69 21.49,75.97 25.38,75.97 25.45,75.89 v27.58,75.89 31.62,75.89 33.3,74.22 33.76,74.22 34.98,75.44 34.98,78.87 36.73,80.62 38.41,80.62 38.86,80.16 38.86,78.56 38.79,78.49 JP23.1 38.71,78.41 38.71,77.8 34.75,73.84 v34.75,68.43 34.75,67.89 | 20.77,76.69 v18.21,74.14 | P1.8 17.68,105.77 20.12,105.77 P1.6 20.19,105.77 22.63,105.77 P1.4 22.71,105.69 22.71,103.25 P1.3 22.63,103.17 20.19,103.17 P1.5 | 38.48,72.39 38.48,73.61 JP2.3 | 34.75,67.89 36.5,67.89 38.41,69.8 JP2.9 38.48,69.88 39.24,70.64 39.24,71.4 38.48,72.16 38.48,72.39 | 34.75,67.89 v32.23,67.89 | 38.48,72.39 JP2.5 | v35.36,10.06 33.15,12.27 J3.GND 33.15,12.34 35.28,14.48 v35.28,20.5 35.28,22.02 33.15,24.16 33.15,24.99 J5.GND | J4.GND 5.49,26.75 5.49,29.34 4.72,30.1 4.72,31.47 R36.1 4.72,31.55 4.72,45.72 R19.1 | v18.67,27.28 20.12,25.83 20.12,25.07 J1.GND | v3.89,73.3 4.57,73.99 4.95,73.99 6.93,75.97 6.93,76.43 6.71,76.66 6.71,78.41 JP22.1
  Bottom 0.152: UC1.8 29.41,56.84 30.02,56.24 C5.2 30.1,56.16 31.17,56.16 | UC1.46 34.44,60.73 34.44,60.35 UC1.47 34.52,60.35 34.82,60.35 35.2,59.97 35.2,59.59 34.98,59.36 34.98,58.06 C4.2 34.9,57.99 32.99,56.08 31.62,56.08 31.55,56.16 31.17,56.16 | UC1.20 25.98,63.32 26.44,63.32 26.67,63.55 26.67,64.54 26.44,64.77 25.98,64.77 UC1.23 25.91,64.77 23.55,64.77 23.09,64.31 21.18,64.31 20.19,65.3 SW1.C | C22.2 12.42,69.11 v13.34,70.03 14.1,70.03 v18.21,74.14 | v31.17,56.08 31.17,56.16 | 9.03,80.96 8.46,81.53 IC3.2 8.38,81.61 8.38,81.92 7.09,83.21 7.09,88.54 C15.- | 9.03,80.96 9.07,80.92 11.12,80.92 11.89,81.69 12.34,81.69 C8.2 12.42,81.69 15.77,81.69 17.6,79.86 SW1.D | C27.1 7.85,74.3 6.63,75.51 6.02,75.51 5.56,75.97 5.56,77.34 6.63,78.41 JP22.1 6.71,78.49 8.99,80.77 8.99,80.92 9.03,80.96 | IC5.8 29.41,72.16 29.41,72.47 30.86,73.91 C11.2 30.94,73.99 30.94,75.82 C12.2 30.86,75.89 v27.58,75.89 | 6.97,99.1 2.29,103.78 JP3.1 | 6.97,99.1 7.01,99.06 7.01,96.24 C25.- | 18.67,100.66 18.67,102.18 18.63,102.22 | 18.67,100.66 18.67,97.31 | 18.67,97.31 18.67,95.86 16.46,93.65 16.46,93.42 IC6.1 | 18.63,102.22 17.68,103.17 P1.7 | 18.63,102.22 19.58,103.17 20.12,103.17 P1.5 | 18.67,100.66 16.31,100.66 14.78,99.14 7.01,99.14 6.97,99.1 | v32.23,67.89 32.38,67.74 32.38,66.83 UC1.35 | v34.75,68.43 34.75,67.36 C2.2 | JP23.1 38.71,78.49 36.65,80.54 36.65,83.13 C10.1 36.58,83.21 35.81,83.21 30.48,88.54 C19.- 30.4,88.62 30.4,94.03 29.95,94.49 29.95,95.4 | 29.95,95.4 26.29,95.4 25.53,96.16 C30.+ 25.45,96.24 24.69,96.24 23.62,97.31 18.67,97.31 | 29.95,95.4 32.16,95.4 32.38,95.63 32.38,96.16 36.58,100.36 36.58,101.58 C9.1
  Bottom 0.152: 34.86,20.08 33.6,21.34 31.47,21.34 28.19,24.61 26.9,24.61 26.06,25.45 26.06,25.91 U4.3 25.98,25.98 24.77,25.98 | 34.86,20.08 35.36,19.58 35.36,19.2 J5.C | 24.77,25.98 U4.5 | 24.77,25.98 U4.4 24.77,25.91 23.93,25.07 20.19,25.07 J1.GND | U2.5 11.73,15.32 10.44,15.32 8.61,17.14 2.82,17.14 2.67,16.99 2.67,14.1 4.42,12.34 7.16,12.34 J2.GND 7.24,12.34 8.38,13.49 9.83,13.49 C20.1 9.91,13.49 10.13,13.49 12.95,10.67 12.95,10.13 U2.3 12.95,10.74 13.18,10.74 14.25,11.81 17.45,11.81 C28.2 17.53,11.89 19.74,11.89 20.12,12.27 J6.GND 20.19,12.34 21.26,12.34 22.48,13.56 22.78,13.56 C3.1 | 31.13,27.01 33.07,25.07 J5.GND | 31.13,27.01 31.09,27.05 30.48,27.05 C18.2 | 31.13,27.01 31.32,27.2 31.32,29.34 30.63,30.02 30.63,31.47 R38.1 | J3.GND 33.07,12.27 32.69,11.89 30.48,11.89 C1.2 30.48,11.81 26.98,11.81 25.98,10.82 U3.3 25.98,10.13 25.98,10.74 23.16,13.56 C3.1 | v35.36,10.06 35.36,6.48 J3.C | C3.1 22.86,13.56 23.09,13.56 24.77,15.24 U3.5 | v35.28,20.5 34.86,20.08 | 16.15,27.13 17.45,27.13 C32.2 17.53,27.13 18.17,27.77 | 16.15,27.13 13.79,29.49 12.5,29.49 11.81,30.18 11.81,31.17 U5.5 | 18.17,27.77 21.34,30.94 21.34,32.08 20.65,32.77 18.97,32.77 18.67,33.07 18.67,34.29 19.36,34.98 19.36,35.66 Q6.2 | 4.72,25.07 4.72,26.14 IC8.1 | 4.72,25.07 4.72,24.16 C26.2 | 4.72,25.07 J4.GND 7.24,25.07 8.08,25.91 11.73,25.91 U5.4 11.81,25.98 12.95,25.98 U5.3 12.95,26.06 12.95,26.36 13.95,27.36 14.63,27.36 14.86,27.13 14.86,24.92 15.16,24.61 15.93,24.61 16.15,24.84 16.15,27.13 | 18.52,44.88 17.68,45.72 R20.1 | 18.52,44.88 19.43,43.97 19.43,43.2 R33.1 | 18.52,44.88 15.7,42.06 SW2.A' 15.62,41.99 14.17,41.99 12.34,40.16 10.97,40.16 7.7,43.43 7.7,44.58 7.66,44.62
  Bottom 0.152: 7.66,44.62 7.62,44.58 5.87,44.58 4.72,45.72 R19.1 4.72,45.8 4.72,47.17 6.93,49.38 C31.2 6.93,49.45 6.93,52.88 6.48,53.34 | 7.66,44.62 8.38,45.34 8.38,46.18 9.22,47.02 10.13,47.02 10.21,46.94 12.34,46.94 14.17,48.77 15.62,48.77 SW2.A | 6.4,66.67 6.4,66.45 4.72,64.77 IC4.7 5.03,65 8.53,61.49 8.53,60.43 9.3,59.66 IC4.12 9.83,59.66 9.37,59.66 6.48,56.77 6.48,55.24 | 6.4,66.67 6.4,69.88 5.18,71.09 4.72,71.09 U1.3 4.65,71.17 4.19,71.17 3.35,72.01 3.35,72.77 v3.89,73.3 | 6.4,66.67 C23.2 | 6.48,55.24 6.48,53.34 | 6.48,53.34 C7.2 | 6.48,55.24 C6.2 | 18.17,27.77 v18.67,27.28
  other vias: 16.83,15.88 5.71,13.65 22.86,33.97 32.38,41.91 37.47,42.23 7.3,63.5 12.7,58.42 16.19,56.2 28.26,45.4 24.77,45.72 26.35,42.55 31.75,53.34 24.13,68.58 37.78,64.77 23.81,78.11 28.57,80.96 23.5,84.14 15.56,80.96 11.11,73.66 27.62,62.55 2.86,35.24 14.92,29.21 38.42,30.8 12.7,85.09 4.13,75.88 0.95,75.88 1.91,56.83
  pour Top: 0,0 40.3,0 40.3,108 0,108
  pour Bottom: 0,0 40.3,0 40.3,108 0,108
JTCK
  Bottom 0.152: UC1.37 34.37,65.3 34.37,66.22 33.91,66.67 33.91,68.81 36.04,70.94 36.04,72.54 37.11,73.61 JP2.4
JTDI  (via drill 0.3)
  Top 0.152: v35.66,69.65 37.11,71.09 JP2.8
  Bottom 0.152: v35.66,69.65 35.66,65.53 34.98,64.85 34.44,64.85 UC1.38
JTDO
  Bottom 0.152: UC1.39 34.44,64.31 35.51,64.31 37.19,65.99 37.19,68.73 36.35,69.57 36.35,71.63 37.11,72.39 JP2.6
JTMS  (via drill 0.3)
  Top 0.152: v31.93,65.68 34.59,65.68 36.5,67.59 37.26,67.59 39.55,69.88 39.55,74.91 38.71,75.74 37.95,75.74 37.19,74.98 JP2.2
  Bottom 0.152: v31.93,65.68 31.93,66.75 UC1.34
N$1
  Bottom 0.305: D1.+ 13.87,100.05 13.87,102.03 15.01,103.17 P1.9 15.09,103.33 15.09,105.69 P1.10
N$2
  Bottom 0.305: D2.- 23.62,100.05 23.62,101.58 25.22,103.17 P1.1 25.22,103.33 25.22,105.69 P1.2
N$3
  Bottom 0.229: J6.C 22.48,6.4 23.7,6.4 25.22,4.88 29.26,4.88 30.79,6.4 J3.A
N$4
  Bottom 0.229: J2.C 9.45,6.4 9.45,5.94 10.97,4.42 15.85,4.42 17.83,6.4 J6.A
N$5
  Bottom 0.152: R2.1 1.29,6.48 4.88,6.48 J2.A
N$6
  Bottom 0.229: J1.C 22.48,19.2 23.85,19.2 25.22,20.57 29.41,20.57 30.79,19.2 J5.A
N$7  (via drill 0.3)
  Top 0.152: v30.94,57.23 30.4,57.23 23.7,63.93 23.7,66.37 15.77,74.3 15.77,79.86 v30.63,94.72
  Bottom 0.152: v30.94,57.23 30.94,58.29 UC1.5 | v30.63,94.72 34.98,94.72 37.41,97.16 Q5.2 37.49,97.23 38.25,97.99 38.25,101.58 C9.2
N$8  (via drill 0.3)
  Top 0.152: v30.56,61.19 30.56,62.03 31.32,62.79 31.32,65.38 31.24,65.46 31.24,70.79 37.57,77.11 37.57,79.32 v38.18,79.93
  Bottom 0.152: v30.56,61.19 30.56,59.36 30.48,59.28 30.48,58.37 UC1.6 | v38.18,79.93 38.18,83.06 38.25,83.13 C10.2 38.25,83.21 37.49,83.97 37.49,87.55 Q5.1
N$9
  Bottom 0.229: J4.C 9.45,19.2 10.82,19.2 12.19,20.57 16.46,20.57 17.83,19.2 J1.A
N$10
  Bottom 0.229: R1.1 1.29,18.21 3.96,18.21 4.88,19.13 J4.A
N$11  (via drill 0.3)
  Top 0.229: v1.29,17.07 1.29,18.06 v2.29,19.05 0.69,20.65 0.69,53.11 2.82,55.24 2.82,78.87 3.43,79.48 3.43,82.75 2.29,83.9 2.29,84.73 JP1.2
  Bottom 0.229: v1.29,17.07 1.29,8.15 R2.2 | v2.29,19.05 2.13,19.05 1.29,19.89 R1.2
N$12
  Bottom 0.152: R41.1 14.48,5.71 14.48,7.62 R53.2 14.55,7.62 14.55,8.61 15.54,9.6 15.54,10.06 U2.1
N$13
  Bottom 0.152: R39.1 20.27,47.7 20.27,45.87 20.19,45.8 R20.2
N$14
  Bottom 0.152: R54.1 3.5,2.06 7.09,2.06 J2.IN
N$29  (via drill 0.3)
  Top 0.152: v11.73,5.11 11.73,5.56 8.76,8.53 6.71,8.53 3.89,11.35 v3.89,20.5 | v21.34,46.79 21.34,41.91 21.26,41.83 21.26,41.07 21.95,40.39 25.53,40.39 26.82,39.09 26.82,29.87 27.2,29.49 27.2,27.2 v23.01,23.01 | v11.73,23.24 v11.73,21.87
  Bottom 0.152: R41.2 12.34,5.71 v11.73,5.11 | v3.89,20.5 5.87,20.5 6.71,21.34 11.73,21.34 | 11.73,21.34 12.57,21.34 12.8,21.57 C16.1 | v21.34,46.79 21.34,48.16 20.34,49.15 20.34,49.38 R39.2 | v23.01,23.01 22.33,23.01 20.65,21.34 16.76,21.34 15.24,22.86 15.24,24.16 15.09,24.31 15.01,24.31 14.1,25.22 U5.2 14.25,25.91 14.25,25.45 12.88,24.08 12.88,23.55 R34.1 12.8,23.47 12.57,23.24 v11.73,23.24 | v11.73,21.87 11.73,21.34
N$45  (via drill 0.3)
  Top 0.152: v10.82,5.56 v8.99,3.73
  Bottom 0.152: v8.99,3.73 3.5,3.73 R54.2 | 12.88,7.62 v10.82,5.56 | 12.88,7.62 14.25,8.99 14.25,10.06 U2.2 | 12.88,7.62 R53.1
N$46
  Bottom 0.152: R24.1 36.8,2.06 33.22,2.06 33.15,2.13 J3.IN
N$47
  Bottom 0.152: R48.1 3.5,14.78 7.09,14.78 7.16,14.86 J4.IN
N$48
  Bottom 0.152: R24.2 36.88,3.73 36.88,12.88 39.4,15.39 39.4,43.66 36.04,47.02 34.37,47.02 33.15,45.8 R21.2
N$49
  Bottom 0.152: R49.1 19.58,96.47 19.58,94.79 20.95,93.42 IC6.2 21.03,93.34 21.03,93.04 25.45,88.62 C19.+
N$50  (via drill 0.3)
  Top 0.152: v16.08,22.94 v11.89,18.75
  Bottom 0.152: U2.6 12.95,15.32 12.88,15.39 12.88,17.75 R43.1 12.8,17.83 v11.89,18.75 | v16.08,22.94 16.08,23.09 18.67,25.68 18.67,25.76 20.95,28.04 23.55,28.04 23.7,28.19 23.7,30.48 22.71,31.47 R37.3
N$51
  Bottom 0.152: R30.1 14.48,19.66 14.48,17.83 R43.2 14.48,17.75 14.48,15.47 14.33,15.32 U2.7
N$52
  Bottom 0.152: R52.1 25.83,7.62 25.83,8.15 27.28,9.6 27.28,10.06 U3.2 27.36,10.13 27.36,10.67 28.12,11.43 29.49,11.43 29.87,11.05 34.59,11.05 37.64,14.1 37.64,35.51 35.66,37.49 35.66,45.72 R21.3
N$53
  Bottom 0.152: R42.1 27.51,5.71 27.51,7.62 R52.2 27.58,7.62 27.58,8.61 28.57,9.6 U3.1
N$55  (via drill 0.3)
  Top 0.152: v24.84,6.63 24.84,8 30.18,13.34 30.18,15.62 v24.69,21.11
  Bottom 0.152: v24.84,6.63 25.76,5.71 R42.2 | v24.69,21.11 25.3,21.11 25.76,21.57 C17.1 25.83,21.64 25.83,23.47 R35.1 25.76,23.55 25.6,23.7 19.81,23.7 18.97,24.54 18.97,25.6 20.42,27.05 22.86,27.05 R40.2 22.86,27.13 23.09,27.13 24,28.04 24,32.16 24.35,32.5 | 24.35,32.5 24.38,32.54 25.15,32.54 25.3,32.38 25.3,29.57 27.28,27.58 27.28,25.98 U4.2 | R21.1 30.56,45.72 30.56,41.3 29.34,40.08 23.32,40.08 21.64,38.41 21.64,36.96 24.31,34.29 24.31,32.54 24.35,32.5
N$57  (via drill 0.3)
  Top 0.152: v19.13,37.03 19.13,36.58 16,33.45 16,25.6 16.84,24.77 16.84,17.22 19.13,14.94 20.12,14.94 J1.IN
  Bottom 0.152: v19.13,37.03 19.66,37.03 20.12,36.58 20.12,34.9 19.51,34.29 19.51,33.68 R29.1
N$58
  Bottom 0.152: R31.1 27.51,19.66 27.51,17.83 R44.2 27.51,17.75 27.51,15.47 27.36,15.32 U3.7
N$59  (via drill 0.3)
  Top 0.152: v17.98,17.83 17.98,31.17 17.68,31.47 R37.1
  Bottom 0.152: R28.2 7.01,35.74 12.5,35.74 12.72,35.51 C13.1 12.8,35.51 12.8,33.68 R25.1 12.88,33.6 12.95,33.53 12.95,32.54 | 12.95,32.54 12.95,31.24 U5.6 | v17.98,17.83 16.31,17.83 15.01,16.54 15.01,14.25 14.71,13.95 13.87,13.95 13.72,14.1 13.72,18.29 12.88,19.13 12.88,19.66 R30.2 | 12.95,32.54 16.61,32.54 17.6,31.55 R37.1
N$60
  Bottom 0.152: R47.1 36.8,14.78 33.22,14.78 33.15,14.86 J5.IN
N$61
  Bottom 0.152: R28.1 7.01,34.06 7.01,31.7 R36.2
N$62  (via drill 0.3)
  Top 0.152: v21.11,16.92 21.11,17.14 22.33,18.36 22.33,29.34 20.19,31.47 R37.2
  Bottom 0.152: v21.11,16.92 20.5,16.92 18.97,15.39 18.97,13.64 18.14,12.8 12.5,12.8 8.91,16.38 3.5,16.38 R48.2
N$63
  Bottom 0.152: R44.1 25.83,17.75 25.83,15.47 25.98,15.32 U3.6 26.06,15.24 26.06,14.33 27.66,12.72 31.09,12.72 31.32,12.95 31.32,14.78 32.92,16.38 36.8,16.38 R47.2
N$65
  Bottom 0.152: R32.1 33.07,33.76 33.07,31.55 R38.2
N$66
  Bottom 0.152: R29.2 21.18,33.68 21.18,35.59 21.26,35.66 Q6.1
N$67  (via drill 0.3)
  Top 0.152: v11.2,66.83 v8.23,69.8
  Bottom 0.152: U1.6 9.91,71.09 9.91,69.88 U1.7 9.83,69.8 v8.23,69.8 | C24.+ 19.96,72.77 19.96,69.11 18.29,67.44 18.14,67.44 C21.2 18.06,67.36 17.37,66.67 11.73,66.67 11.58,66.83 v11.2,66.83
N$68  (via drill 0.3)
  Top 0.152: v4.88,73.3 6.4,73.3 8.23,75.13 v10.21,75.13
  Bottom 0.152: v4.88,73.3 2.44,75.74 2.29,75.74 R50.2 | v10.21,75.13 18.75,75.13 C24.-
N$69
  Bottom 0.152: R46.1 14.25,67.44 12.42,67.44 C22.1 12.42,67.51 12.42,67.67 11.28,68.81 11.28,71.48 10.36,72.39 U1.5
N$70
  Bottom 0.152: 25.83,34.75 25.83,35.51 C14.1 | 25.83,34.75 25.83,33.68 R26.1 25.83,33.6 25.83,31.39 25.98,31.24 U4.6 26.06,31.17 26.06,30.63 29.11,27.58 29.11,27.05 32.31,23.85 33.45,23.85 36.42,20.88 36.42,18.36 35.36,17.3 32.31,17.3 28.96,13.95 26.9,13.95 26.75,14.1 26.75,18.29 25.83,19.2 25.83,19.66 R31.2 | 25.83,34.75 30.48,34.75 31.17,35.43 32.99,35.43 R32.2
N$71
  Bottom 0.152: R46.2 14.33,69.11 16.15,69.11 R45.1 16.23,69.11 18.06,69.11 C21.1
N$72  (via drill 0.3)
  Top 0.152: v1.37,32.99 4.57,29.79 4.57,13.18 6.63,11.12 7.47,11.12 16.38,2.21 20.12,2.21 J6.IN
  Bottom 0.152: R56.1 2.29,72.01 3.05,72.77 3.05,74.68 2.9,74.83 1.52,74.83 1.07,74.37 1.07,64.08 2.21,62.94 2.21,62.71 R55.1 2.21,62.64 0.91,61.34 0.91,37.49 1.37,37.03 v1.37,32.99
N$73
  Bottom 0.152: R55.2 2.21,64.39 2.21,66.45 C29.2 2.29,66.52 2.59,66.52 4.65,68.58 U1.1
N$75
  Bottom 0.152: 2.21,69.88 2.21,70.26 R56.2 | 2.21,69.88 2.21,68.2 C29.1 | R50.1 2.21,74.07 2.21,73.38 1.37,72.54 1.37,71.17 2.21,70.33 R56.2 | 2.21,69.88 4.65,69.88 U1.2 | 2.21,69.88 R56.2
PARAM1_CV  (via drill 0.3)
  Top 0.152: v5.33,48.69 5.33,46.79 5.94,46.18 5.94,36.96 v6.1,36.8
  Bottom 0.152: R25.2 14.48,33.68 14.48,35.51 C13.2 14.4,35.51 14.25,35.51 13.41,36.35 7.85,36.35 7.62,36.58 6.4,36.58 6.36,36.54 | 6.36,36.54 6.17,36.35 6.17,35.2 6.55,34.82 9.83,34.82 12.42,32.23 12.42,30.02 12.65,29.79 13.41,29.79 14.25,30.63 14.25,31.17 U5.7 | v5.33,48.69 5.33,53.03 4.72,53.65 4.72,57.15 IC4.1 | 6.36,36.54 v6.1,36.8
PARAM2_CV  (via drill 0.3)
  Top 0.152: v6.4,57.61 6.4,54.1 v22.33,38.18
  Bottom 0.152: U4.7 27.36,31.24 27.51,31.39 27.51,33.6 R26.2 27.58,33.68 29.87,33.68 30.71,34.52 33.53,34.52 33.83,34.82 33.83,36.04 33.68,36.2 31.47,36.2 30.86,35.59 27.58,35.59 C14.2 27.51,35.59 26.75,36.35 23.77,36.35 22.33,37.8 v22.33,38.18 | v6.4,57.61 5.64,58.37 4.72,58.37 IC4.2
PITCH_CV
  Bottom 0.152: 14.48,22.55 14.48,23.47 R34.2 | 14.48,22.55 14.48,21.64 C16.2 | 14.48,22.55 8.84,22.55 7.7,23.7 5.64,23.7 5.26,23.32 4.04,23.32 3.89,23.47 3.89,26.9 4.65,27.66 6.86,27.66 | 6.86,27.66 14.78,27.66 15.54,26.9 15.54,25.98 U5.1 | 6.86,27.66 6.86,29.57 5.94,30.48 5.94,31.93 5.41,32.46 5.41,39.55 3.5,41.45 3.5,46.41 4.65,47.55 4.65,53.26 3.35,54.56 3.35,58.83 4.19,59.66 4.65,59.66 IC4.3
RESET  (via drill 0.3)
  Top 0.152: v37.87,67.28 36.65,67.28 35.66,66.29 35.66,65.38 v29.87,59.59 29.87,59.66 28.88,59.66 v28.19,60.35 | v9.37,44.27 9.37,44.42 8.46,45.34 8.46,46.25 v9.91,47.7
  Bottom 0.152: v29.87,59.59 29.87,58.37 UC1.7 | v37.87,67.28 37.87,69.11 37.19,69.8 JP2.10 | v9.37,44.27 11.58,42.06 SW2.B' | v9.91,47.7 10.52,47.7 11.58,48.77 SW2.B 11.66,48.84 13.49,50.67 13.49,52.88 14.94,54.33 16.54,54.33 19.05,51.82 19.43,51.82 R22.1 19.51,51.82 22.02,54.33 26.9,54.33 27.36,54.79 27.36,55.24 27.05,55.55 27.05,58.9 28.19,60.05 v28.19,60.35
RX  (via drill 0.3)
  Top 0.152: v22.71,88.85 9.6,88.85 2.29,96.16 JP3.4
  Bottom 0.152: v22.71,88.85 22.71,88.77 32.31,79.17 32.31,77.95 31.85,77.5 31.85,70.64 30.48,69.27 30.48,66.83 UC1.31
TX  (via drill 0.3)
  Top 0.152: v29.79,68.58 29.79,71.93 26.44,75.29 v25.15,75.29
  Bottom 0.152: v29.79,68.58 29.87,68.5 29.87,66.83 UC1.30 | v25.15,75.29 25.15,85.5 22.02,88.62 22.02,89.38 19.13,92.28 3.66,92.28 2.29,93.65 JP3.5
VCC  (via drill 0.3)
  Top 0.305: v29.34,13.41 29.34,15.24 v29.49,15.39 29.26,15.32 28.42,16.15 v18.82,16.15 18.75,16.23 18.52,16.23 17.22,17.53 17.22,30.18 16.38,31.01 16.38,33.22 19.89,36.73 19.89,40.01 5.64,54.25 5.64,66.14 v7.32,67.82 v8.23,68.73
  Bottom 0.305: 16.76,14.1 15.62,15.24 U2.8 | 16.76,14.1 17.3,13.56 17.45,13.56 C28.1 | v29.34,13.41 29.41,13.49 30.48,13.49 C1.1 | v29.49,15.39 28.65,15.39 28.57,15.32 U3.8 | v18.82,16.15 16.76,14.1 | D1.- 17.3,99.97 17.83,99.44 17.83,96.55 R49.2 17.68,96.55 12.34,96.55 12.04,96.24 C25.+ 11.89,96.16 9.68,96.16 8.46,94.94 1.68,94.94 0.91,94.18 0.91,83.67 2.21,82.37 JP1.1 2.29,82.22 5.41,79.1 5.41,77.88 5.18,77.65 5.18,74.07 5.87,73.38 6.02,73.38 7.16,72.24 7.16,68.28 7.47,67.97 | 7.47,67.97 8.08,67.36 8.08,66.67 C23.1 | U1.8 8.38,68.58 v8.23,68.73 | v7.32,67.82 7.47,67.97
VEE  (via drill 0.3)
  Top 0.305: v5.49,21.18 5.49,20.65 4.95,20.12 4.95,18.29 7.09,16.15 7.7,16.15 8.76,15.09 8.76,13.56 | v8.76,12.72 8.76,13.56 | v21.72,11.89 21.72,12.5 20.65,13.56 8.76,13.56 | v24.54,97.31 24.54,89.61 23.01,88.09 18.67,88.09 13.49,82.91 13.49,77.34 9.45,73.3 7.32,73.3 v7.24,73.23 7.24,72.77 v6.4,71.93 5.18,70.71 5.18,52.12 3.43,50.37 v3.43,40.62
  Bottom 0.305: U3.4 24.77,10.13 23.09,11.81 22.86,11.81 C3.2 22.78,11.89 v21.72,11.89 | v5.49,21.18 4.72,21.95 4.72,22.17 R51.1 4.65,21.87 4.12,21.87 3.58,21.34 2.36,21.34 1.98,21.72 1.98,32.54 4.72,35.28 4.72,39.32 v3.43,40.62 | v8.76,12.72 8.99,12.72 9.83,11.89 C20.2 9.98,11.89 11.73,10.13 U2.4 | v7.24,73.23 6.48,73.99 6.48,74.3 C27.2 | v6.4,71.93 5.18,71.93 4.72,72.39 U1.4 | 24.57,97.35 24.84,97.08 29.57,97.08 30.4,96.24 C30.- | 24.57,97.35 21.95,99.97 20.27,99.97 D2.+ | v24.54,97.31 24.57,97.35

### Text on the board
tPlace: ANTUMBRA | KNOT
bPlace: FTDI | OFF | ON | ANTUMBRA | JACK LIGHTS | JTAG | V1.0 | KNOT
tNames: cc-by-sa / Olivier Gillet / 2015. v5 | Design by: / Olivier Gillet / Redesign by: / David Szebenyi
bNames: GND | RX | TX | RESET | SYSBOOT